# Altium schematic sheet Receive.SchDoc
size A; SheetNumber: 2; SheetTotal: 3
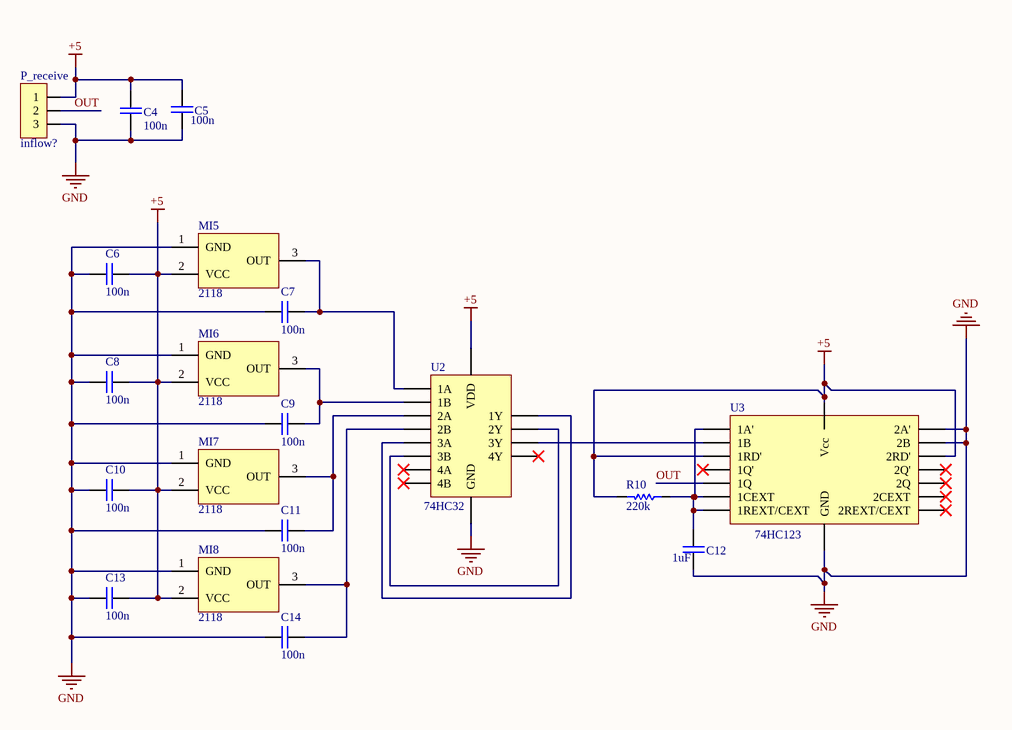
[diagram p0: Receive.SchDoc]

## Parts
C4  100n  [CAP 1206/3216]
C5  100n  [CAP 1206/3216]
C6  100n  [CAP 1206/3216]
C7  100n  [CAP 1206/3216]
C8  100n  [CAP 1206/3216]
C9  100n  [CAP 1206/3216]
C10  100n  [CAP 1206/3216]
C11  100n  [CAP 1206/3216]
C12  1uF  [CAP 1206/3216]
C13  100n  [CAP 1206/3216]
C14  100n  [CAP 1206/3216]
MI5  Inflow: 2118  [TSOP1238]  (hidden comment: TSOP1138)
MI6  Inflow: 2118  [TSOP1238]  (hidden comment: TSOP1138)
MI7  Inflow: 2118  [TSOP1238]  (hidden comment: TSOP1138)
MI8  Inflow: 2118  [TSOP1238]  (hidden comment: TSOP1138)
P_receive  Inflow: inflow?  [MOLEX KK 0022272031]  (hidden comment: 3'Pin)
R10  220k  [RES 1206 (3216X08L)]
U2  74HC32  [SOIC-14]
U3  74HC123  [SOIC-16]

## Nets
+5: C4.1 C5.1 C6.1 C8.1 C10.1 C13.1 MI5.2(VCC) MI6.2(VCC) MI7.2(VCC) MI8.2(VCC) P_receive.1 R10.2 U2.14(VDD) U3.2(1RD') U3.10(2RD') U3.15(Vcc)
GND: C4.2 C5.2 C6.2 C7.1 C8.2 C9.2 C10.2 C11.1 C12.2 C13.2 C14.1 MI5.1(GND) MI6.1(GND) MI7.1(GND) MI8.1(GND) P_receive.3 U2.7(GND) U3.7(GND) U3.8(2A') U3.9(2B)
OUT: P_receive.2 U3.12(1Q)
NetC7_2: C7.2 MI5.3(OUT) U2.1(1A)
NetC9_1: C9.1 MI6.3(OUT) U2.2(1B)
NetC11_2: C11.2 MI7.3(OUT) U2.4(2A)
NetC12_1: C12.1 R10.1 U3.0(1A') U3.13(1CEXT) U3.14(1REXT/CEXT)
NetC14_2: C14.2 MI8.3(OUT) U2.5(2B)
NetU2_3: U2.3(1Y) U2.9(3A)
NetU2_6: U2.6(2Y) U2.10(3B)
NetU2_8: U2.8(3Y) U3.1(1B)

Not connected (* = marked no-connect by the designer): U2 11(4Y)* 12(4A)* 13(4B)*; U3 3(1Q')* 4(2Q)* 5(2CEXT)* 6(2REXT/CEXT)* 11(2Q')*

## Library data of the parts
C4-C14 = Cap_Multi_SMD_1206: Bipolar ceramic capacitor SMD; Inflow: inflow?; Type: MultiLayer; Rating: Rating?; Validation: Valid; Package: 1206
  C4-C11 C13 C14: Value: 100n
  C12: Value: 1uF
MI5-MI8 = ModSen_IR_TSOP1138: Reciver Remot Control (IR) 30-56KHz; Rating: Rating?; Validation: NT; Value: TSOP1138; Package: Package?; Type: Type?
P_receive = Con_Signal_3: Signal Connector 3'Pin; Rating: Rating?; Validation: Valid; Value: 3'Pin; Package: Package?; Type: Type?
R10 = Res_SMD_1206: Resistor; Inflow: inflow?; Rating: 0.25W; Validation: Valid; Package: 1206; Type: 10%; Value: 220k
U2 = 74HC32: Quadruple 2-Input Positive OR Gate; value: 74HC32
U3 = 74HC123: Dual retriggerable monostable multivibrator with reset; value: 74HC123